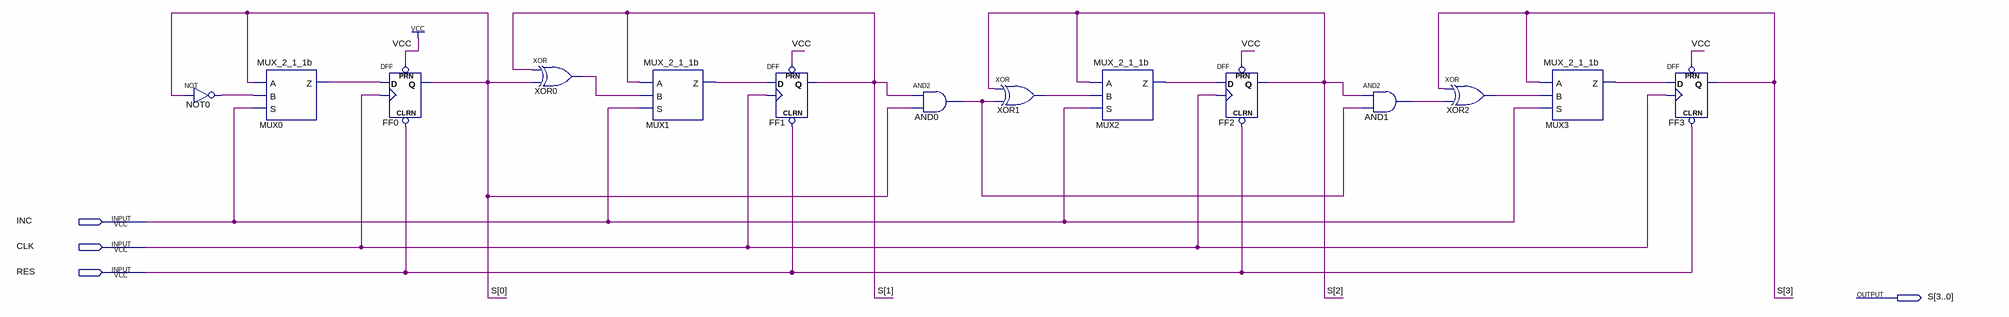
[diagram p0: schematic sheet]
// Quartus schematic REG_INC_4b.bdf as structural Verilog: 14 symbols, 4 pins
module REG_INC_4b (
  input  INC,
  input  CLK,
  input  RES,
  output [3:0] S
);

  wire AND0_out, AND1_out, MUX0_z, MUX1_z, MUX2_z, MUX3_z, NOT0_out, XOR0_out, XOR1_out, XOR2_out;

  not NOT0 (NOT0_out, S[0]);
  MUX_2_1_1b MUX0 (.A(S[0]), .B(NOT0_out), .S(INC), .Z(MUX0_z));
  DFF FF0 (.CLRN(RES), .CLK(CLK), .D(MUX0_z), .PRN(1'b1), .Q(S[0]));
  xor XOR0 (XOR0_out, S[1], S[0]);
  MUX_2_1_1b MUX1 (.A(S[1]), .B(XOR0_out), .S(INC), .Z(MUX1_z));
  DFF FF1 (.CLRN(RES), .CLK(CLK), .D(MUX1_z), .PRN(1'b1), .Q(S[1]));
  and AND0 (AND0_out, S[1], S[0]);
  xor XOR1 (XOR1_out, S[2], AND0_out);
  MUX_2_1_1b MUX2 (.A(S[2]), .B(XOR1_out), .S(INC), .Z(MUX2_z));
  DFF FF2 (.CLRN(RES), .CLK(CLK), .D(MUX2_z), .PRN(1'b1), .Q(S[2]));
  and AND1 (AND1_out, S[2], AND0_out);
  xor XOR2 (XOR2_out, S[3], AND1_out);
  MUX_2_1_1b MUX3 (.A(S[3]), .B(XOR2_out), .S(INC), .Z(MUX3_z));
  DFF FF3 (.CLRN(RES), .CLK(CLK), .D(MUX3_z), .PRN(1'b1), .Q(S[3]));
endmodule
